# EAGLE design VIC-MIDI_v0.9 (EAGLE 5.11)
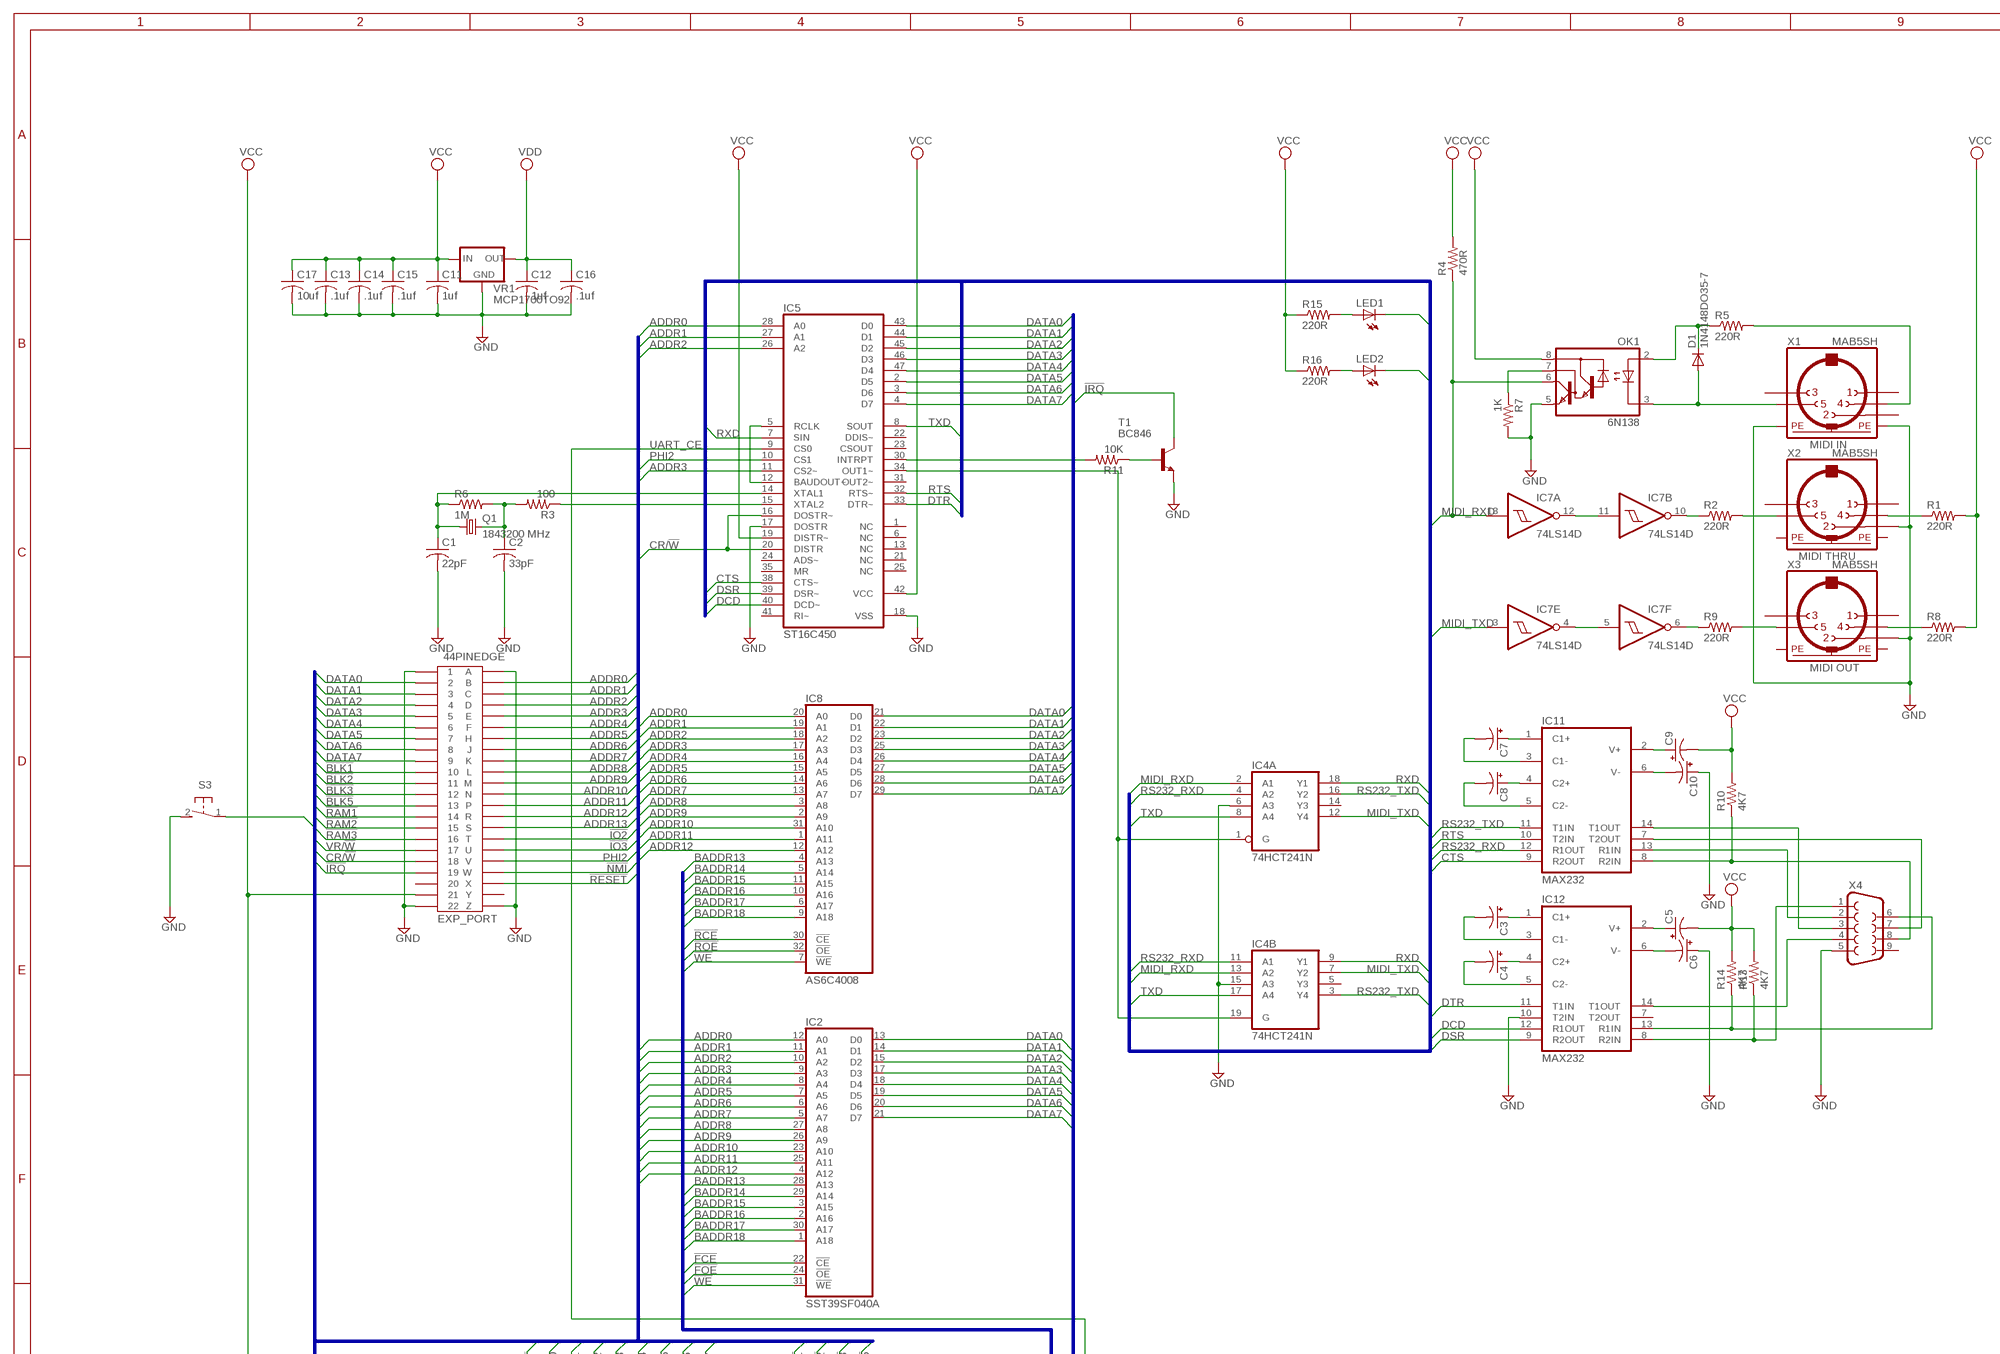
[diagram p0: schematic, sheet 1, part 1 of 3]
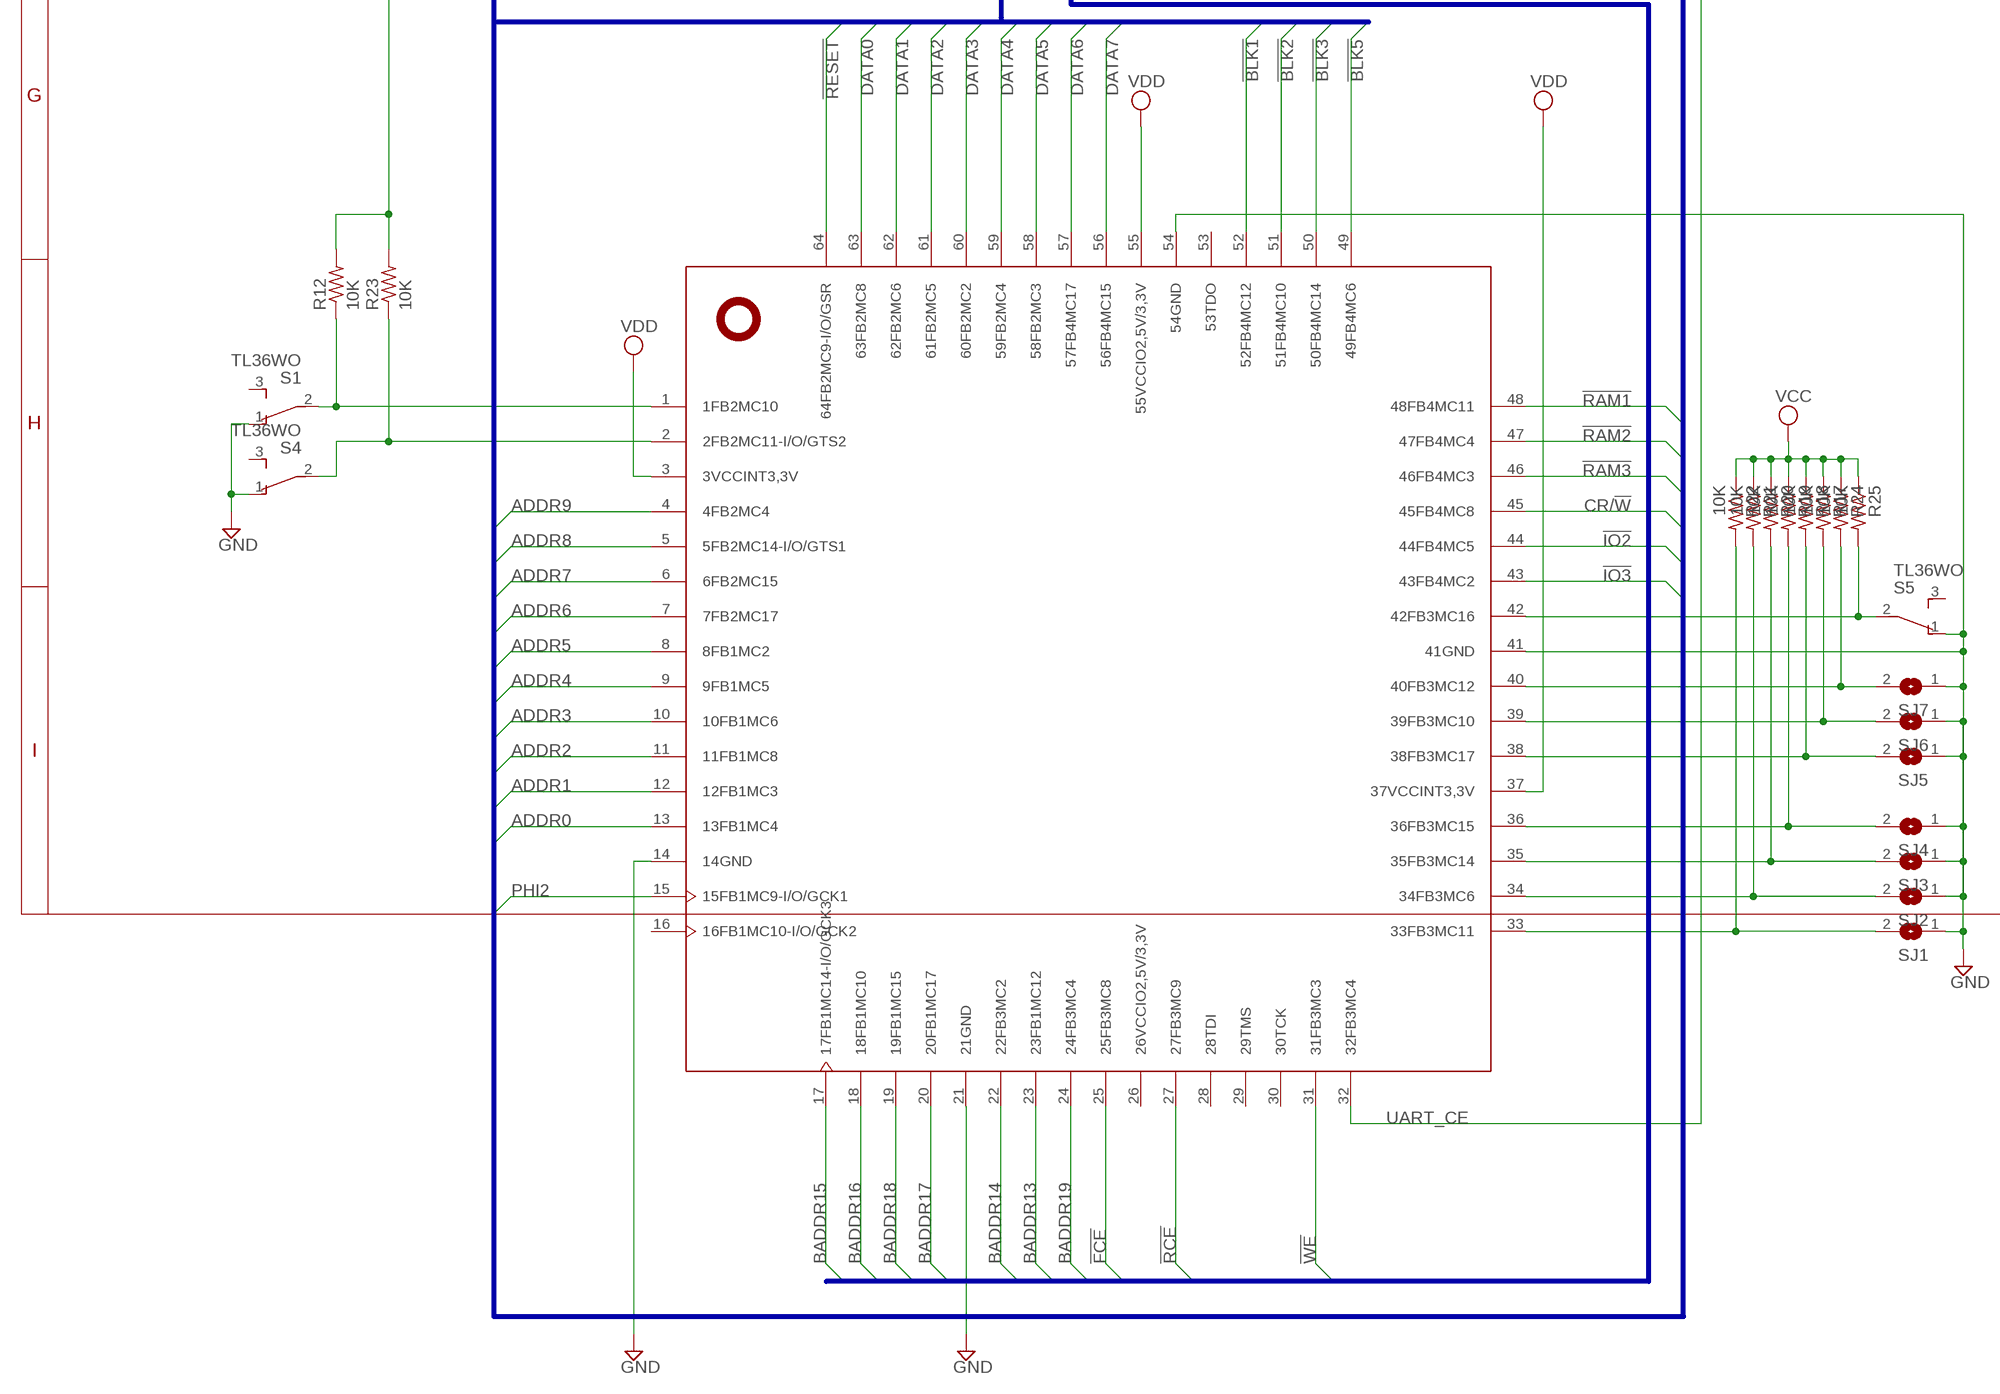
[diagram p1: schematic, sheet 1, part 2 of 3]
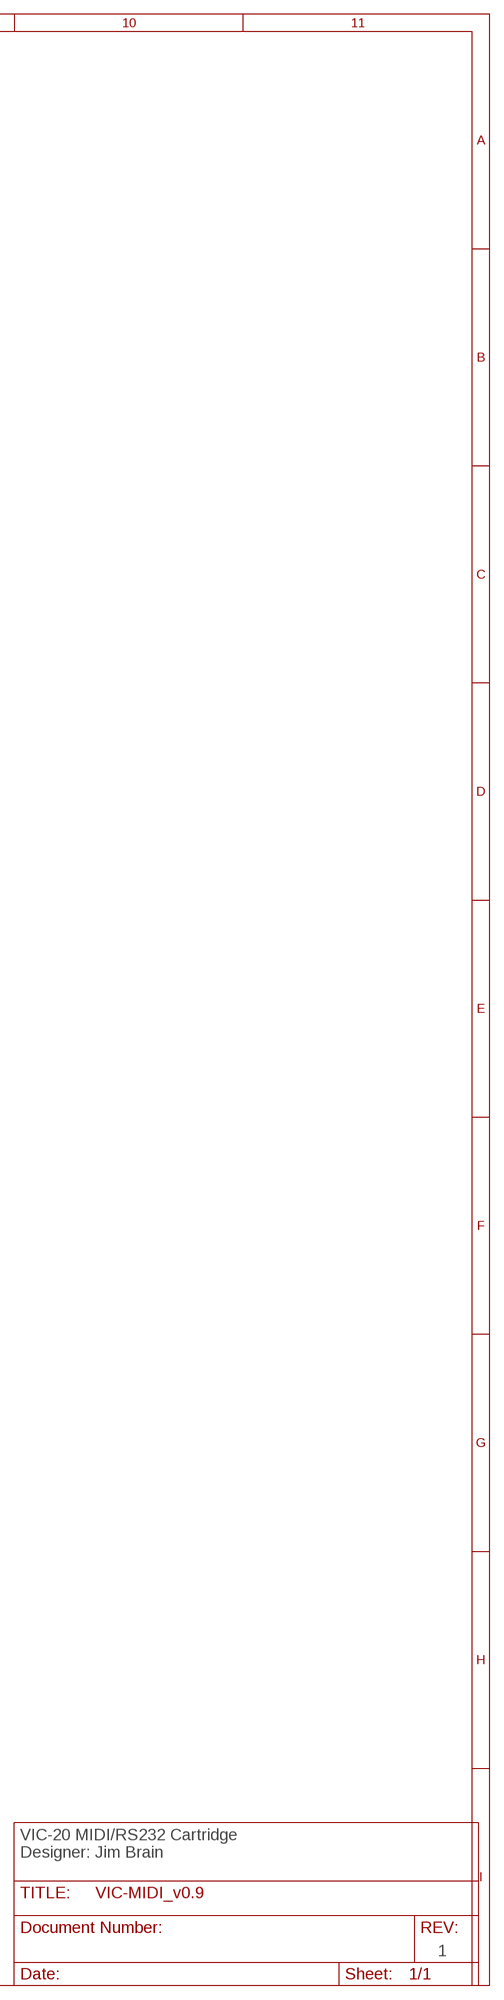
[diagram p2: schematic, sheet 1, part 3 of 3]

## Parts
44PINEDGE  EXP_PORT  MA-44  [MA-44]
C1  22pF  C-USC0805  [C0805]
C2  33pF  C-USC0805  [C0805]
C3  CPOL-USE2-4  [E2-4]
C4  CPOL-USE2-4  [E2-4]
C5  CPOL-USE2-4  [E2-4]
C6  CPOL-USE2-4  [E2-4]
C7  CPOL-USE2-4  [E2-4]
C8  CPOL-USE2-4  [E2-4]
C9  CPOL-USE2-4  [E2-4]
C10  CPOL-USE2-4  [E2-4]
C11  1uf  C-USC0805  [C0805]
C12  1uf  C-USC0805  [C0805]
C13  .1uf  C-USC0805  [C0805]
C14  .1uf  C-USC0805  [C0805]
C15  .1uf  C-USC0805  [C0805]
C16  .1uf  C-USC0805  [C0805]
C17  10uf  C-USC0805  [C0805]
D1  1N4148DO35-7  [DO35-7]
IC1  XC9572XLVQ64  [VQ64]
IC2  SST39SF040A  AM29F040J  [PLCC32R]
IC4  74HCT241N  74LS241DW  [SO20W]
IC5  ST16C450  XR-16C450Q  [TQFP48]
IC7  74LS14D  [SO14]
IC8  AS6C4008  SST39VF040W  [TSOP32]
IC11  MAX232  [DIL16]
IC12  MAX232  [DIL16]
LED1  LED3MM  [LED3MM]
LED2  LED3MM  [LED3MM]
OK1  6N138  [DIL08]
Q1  1843200 MHz  CRYSTALHC49UP  [HC49UP]
R1  220R  R-US_R0805  [R0805]
R2  220R  R-US_R0805  [R0805]
R3  100  R-US_R0805  [R0805]
R4  470R  R-US_R0805  [R0805]
R5  220R  R-US_R0805  [R0805]
R6  1M  R-US_R0805  [R0805]
R7  1K  R-US_R0805  [R0805]
R8  220R  R-US_R0805  [R0805]
R9  220R  R-US_R0805  [R0805]
R10  4K7  R-US_M0805  [M0805]
R11  10K  R-US_R0805  [R0805]
R12  10K  R-US_R0805  [R0805]
R13  4K7  R-US_R0805  [R0805]
R14  4K7  R-US_R0805  [R0805]
R15  220R  R-US_R0805  [R0805]
R16  220R  R-US_R0805  [R0805]
R17  10K  R-US_M0805  [M0805]
R18  10K  R-US_M0805  [M0805]
R19  10K  R-US_M0805  [M0805]
R20  10K  R-US_M0805  [M0805]
R21  10K  R-US_M0805  [M0805]
R22  10K  R-US_M0805  [M0805]
R23  10K  R-US_R0805  [R0805]
R24  10K  R-US_M0805  [M0805]
R25  10K  R-US_M0805  [M0805]
S1  TL36WO  [TL3XWO]
S3  31-XX  [B3F-31XX]
S4  TL36WO  [TL3XWO]
S5  TL36WO  [TL3XWO]
SJ1  SJ  [SJ]
SJ2  SJ  [SJ]
SJ3  SJ  [SJ]
SJ4  SJ  [SJ]
SJ5  SJ  [SJ]
SJ6  SJ  [SJ]
SJ7  SJ  [SJ]
T1  BC846  [SOT23]
VR1  MCP1700TO92  [TO92]
X1  MAB5SH  [MAB5SH]
X2  MAB5SH  [MAB5SH]
X3  MAB5SH  [MAB5SH]
X4  F09HP  [F09HP]

## Nets
!BLK1: 44PINEDGE.10 IC1.52(52FB4MC12)
!BLK2: 44PINEDGE.11 IC1.51(51FB4MC10)
!BLK3: 44PINEDGE.12 IC1.50(50FB4MC14)
!BLK5: 44PINEDGE.13 IC1.49(49FB4MC6)
!FCE: IC1.25(25FB3MC8) IC2.22(!CE)
!FOE: IC2.24(!OE)
!IO2: 44PINEDGE.T IC1.44(44FB4MC5)
!IO3: 44PINEDGE.U IC1.43(43FB4MC2)
!IRQ: 44PINEDGE.19 T1.3(C)
!NMI: 44PINEDGE.W
!RAM1: 44PINEDGE.14 IC1.48(48FB4MC11)
!RAM2: 44PINEDGE.15 IC1.47(47FB4MC4)
!RAM3: 44PINEDGE.16 IC1.46(46FB4MC3)
!RCE: IC1.27(27FB3MC9) IC8.30(!CE)
!RESET: 44PINEDGE.X IC1.64(64FB2MC9-I/O/GSR) S3.1(P)
!ROE: IC8.32(!OE)
!WE: IC1.31(31FB3MC3) IC2.31(!WE) IC8.7(!WE)
ADDR0: 44PINEDGE.B IC1.13(13FB1MC4) IC2.12(A0) IC5.28(A0) IC8.20(A0)
ADDR1: 44PINEDGE.C IC1.12(12FB1MC3) IC2.11(A1) IC5.27(A1) IC8.19(A1)
ADDR2: 44PINEDGE.D IC1.11(11FB1MC8) IC2.10(A2) IC5.26(A2) IC8.18(A2)
ADDR3: 44PINEDGE.E IC1.10(10FB1MC6) IC2.9(A3) IC5.11(CS2~) IC8.17(A3)
ADDR4: 44PINEDGE.F IC1.9(9FB1MC5) IC2.8(A4) IC8.16(A4)
ADDR5: 44PINEDGE.H IC1.8(8FB1MC2) IC2.7(A5) IC8.15(A5)
ADDR6: 44PINEDGE.J IC1.7(7FB2MC17) IC2.6(A6) IC8.14(A6)
ADDR7: 44PINEDGE.K IC1.6(6FB2MC15) IC2.5(A7) IC8.13(A7)
ADDR8: 44PINEDGE.L IC1.5(5FB2MC14-I/O/GTS1) IC2.27(A8) IC8.3(A8)
ADDR9: 44PINEDGE.M IC1.4(4FB2MC4) IC2.26(A9) IC8.2(A9)
ADDR10: 44PINEDGE.N IC2.23(A10) IC8.31(A10)
ADDR11: 44PINEDGE.P IC2.25(A11) IC8.1(A11)
ADDR12: 44PINEDGE.R IC2.4(A12) IC8.12(A12)
ADDR13: 44PINEDGE.S
BADDR13: IC1.23(23FB1MC12) IC2.28(A13) IC8.4(A13)
BADDR14: IC1.22(22FB3MC2) IC2.29(A14) IC8.5(A14)
BADDR15: IC1.17(17FB1MC14-I/O/GCK3) IC2.3(A15) IC8.11(A15)
BADDR16: IC1.18(18FB1MC10) IC2.2(A16) IC8.10(A16)
BADDR17: IC1.20(20FB1MC17) IC2.30(A17) IC8.6(A17)
BADDR18: IC1.19(19FB1MC15) IC2.1(A18) IC8.9(A18)
BADDR19: IC1.24(24FB3MC4)
CR/!W: 44PINEDGE.18 IC1.45(45FB4MC8) IC5.16(DOSTR~) IC5.20(DISTR)
CTS: IC5.38(CTS~) IC11.9(R2OUT)
DATA0: 44PINEDGE.2 IC1.63(63FB2MC8) IC2.13(D0) IC5.43(D0) IC8.21(D0)
DATA1: 44PINEDGE.3 IC1.62(62FB2MC6) IC2.14(D1) IC5.44(D1) IC8.22(D1)
DATA2: 44PINEDGE.4 IC1.61(61FB2MC5) IC2.15(D2) IC5.45(D2) IC8.23(D2)
DATA3: 44PINEDGE.5 IC1.60(60FB2MC2) IC2.17(D3) IC5.46(D3) IC8.25(D3)
DATA4: 44PINEDGE.6 IC1.59(59FB2MC4) IC2.18(D4) IC5.47(D4) IC8.26(D4)
DATA5: 44PINEDGE.7 IC1.58(58FB2MC3) IC2.19(D5) IC5.2(D5) IC8.27(D5)
DATA6: 44PINEDGE.8 IC1.57(57FB4MC17) IC2.20(D6) IC5.3(D6) IC8.28(D6)
DATA7: 44PINEDGE.9 IC1.56(56FB4MC15) IC2.21(D7) IC5.4(D7) IC8.29(D7)
DCD: IC5.40(DCD~) IC12.12(R1OUT)
DSR: IC5.39(DSR~) IC12.9(R2OUT)
DTR: IC5.33(DTR~) IC12.11(T1IN)
EIA_CTS: IC11.8(R2IN) R10.1 X4.8
EIA_DSR: IC12.13(R1IN) R14.1 X4.6
EIA_DTR: IC12.14(T1OUT) X4.4
EIA_RTS: IC11.7(T2OUT) X4.7
EIA_RXD: IC11.13(R1IN) X4.2
EIA_TXD: IC11.14(T1OUT) X4.3
GND: 44PINEDGE.1 44PINEDGE.22 44PINEDGE.A 44PINEDGE.Z C1.2 C2.2 C6.+ C10.+ C11.2 C12.2 C13.2 C14.2 C15.2 C16.2 C17.2 IC1.14(14GND) IC1.21(21GND) IC1.41(41GND) IC1.54(54GND) IC4.6(A:A3) IC4.15(B:A3) IC5.17(DOSTR) IC5.18(VSS) IC12.10(T2IN) OK1.5(GND) R7.2 S1.1(O) S3.2(S) S4.1(O) S5.1(O) SJ1.1 SJ2.1 SJ3.1 SJ4.1 SJ5.1 SJ6.1 SJ7.1 T1.2(E) VR1.1(GND) X1.PE X1.PE@(PE) X2.2 X3.2 X4.5
MIDI_RXD: IC4.2(A:A1) IC4.13(B:A2) IC7.13(A:I) OK1.6(VO) R4.1
MIDI_TXD: IC4.7(B:Y2) IC4.12(A:Y4) IC7.3(E:I)
N$1: R9.2 X3.5
N$2: IC7.6(F:O) R9.1
N$3: R8.1 X3.4
N$4: IC7.4(E:O) IC7.5(F:I)
N$5: LED1.A R15.2
N$6: D1.C OK1.2(A) R5.1
N$7: R5.2 X1.4
N$8: D1.A OK1.3(C) X1.5
N$9: OK1.7(VB) R7.1
N$10: R2.2 X2.5
N$11: IC7.10(B:O) R2.1
N$12: IC7.11(B:I) IC7.12(A:O)
N$13: R1.1 X2.4
N$14: IC1.2(2FB2MC11-I/O/GTS2) R23.1 S4.2(P)
N$15: IC5.15(XTAL2) R3.1
N$16: C1.1 IC5.14(XTAL1) Q1.1 R6.1
N$17: C2.1 Q1.2 R3.2 R6.2
N$18: IC1.42(42FB3MC16) R25.2 S5.2(P)
N$19: IC5.5(RCLK) IC5.12(BAUDOUT~)
N$20: IC1.36(36FB3MC15) R19.2 SJ4.2
N$21: IC1.38(38FB3MC17) R18.2 SJ5.2
N$23: IC1.39(39FB3MC10) R17.2 SJ6.2
N$24: IC1.40(40FB3MC12) R24.2 SJ7.2
N$25: LED2.A R16.2
N$26: IC1.34(34FB3MC6) R21.2 SJ2.2
N$27: IC1.1(1FB2MC10) R12.1 S1.2(P)
N$28: IC1.35(35FB3MC14) R20.2 SJ3.2
N$29: IC1.33(33FB3MC11) R22.2 SJ1.2
N$31: IC5.30(INTRPT) R11.2
N$32: R11.1 T1.1(B)
N$35: IC4.1(A:G) IC4.19(B:G) IC5.34(OUT1~)
N$36: C3.+ IC12.1(C1+)
N$37: C3.- IC12.3(C1-)
N$38: C4.+ IC12.4(C2+)
N$39: C4.- IC12.5(C2-)
N$40: C5.+ IC12.2(V+)
N$41: C6.- IC12.6(V-)
N$42: C7.+ IC11.1(C1+)
N$43: C7.- IC11.3(C1-)
N$44: C8.+ IC11.4(C2+)
N$45: C8.- IC11.5(C2-)
N$46: C9.+ IC11.2(V+)
N$47: C10.- IC11.6(V-)
N$56: IC12.8(R2IN) R13.1 X4.1
PHI2: 44PINEDGE.V IC1.15(15FB1MC9-I/O/GCK1) IC5.10(CS1)
RS232_RXD: IC4.4(A:A2) IC4.11(B:A1) IC11.12(R1OUT)
RS232_TXD: IC4.3(B:Y4) IC4.16(A:Y2) IC11.11(T1IN)
RTS: IC5.32(RTS~) IC11.10(T2IN)
RXD: IC4.9(B:Y1) IC4.18(A:Y1) IC5.7(SIN) LED2.K(C)
TXD: IC4.8(A:A4) IC4.17(B:A4) IC5.8(SOUT) LED1.K(C)
UART_CE: IC1.32(32FB3MC4) IC5.9(CS0)
VCC: 44PINEDGE.21 C5.- C9.- C11.1 C13.1 C14.1 C15.1 C17.1 IC5.19(DISTR~) IC5.42(VCC) OK1.8(VCC) R1.2 R4.2 R8.2 R10.2 R12.2 R13.2 R14.2 R15.1 R16.1 R17.1 R18.1 R19.1 R20.1 R21.1 R22.1 R23.2 R24.1 R25.1 VR1.2(IN)
VDD: C12.1 C16.1 IC1.3(3VCCINT3,3V) IC1.37(37VCCINT3,3V) IC1.55(55VCCIO2,5V/3,3V) VR1.3(OUT)
VR/!W: 44PINEDGE.17
Unconnected: 44PINEDGE.20 44PINEDGE.Y IC1.16(16FB1MC10-I/O/GCK2) IC1.28(28TDI) IC1.29(29TMS) IC1.30(30TCK) IC1.53(53TDO) IC4.5(B:Y3) IC4.14(A:Y3) IC5.1(NC) IC5.6(NC) IC5.13(NC) IC5.21(NC) IC5.22(DDIS~) IC5.23(CSOUT) IC5.24(ADS~) IC5.25(NC) IC5.31(OUT2~) IC5.35(MR) IC5.41(RI~) IC7.1(D:I) IC7.2(D:O) IC7.8(C:O) IC7.9(C:I) IC12.7(T2OUT) S1.3(S) S4.3(S) S5.3(S) X1.1 X1.2 X1.3 X2.1 X2.3 X3.1 X3.3 X4.9

## Buses
DATA[0..7],ADDR[0..13],VR/!W,CR/!W,!BLK1,!BLK2,!BLK3,!BLK5,!RAM1,!RAM2,!RAM3,!IRQ,!NMI,!IO2,!IO3,PHI2,!RESET
RXD,TXD,DCD,RTS,CTS,DSR,DTR,MIDI_RXD,MIDI_TXD,RS232_RXD,RS232_TXD
BADDR[13..19],!FCE,!FOE,!WE,!RCE,!ROE

## Notes on the sheet
- MIDI IN
- MIDI THRU
- MIDI OUT
- VIC-20 MIDI/RS232 Cartridge
- Designer: Jim Brain
- 1

## Power pins joined to a net without a drawn wire
26VCCIO2,5V/3,3V: IC1.26(26VCCIO2,5V/3,3V)
GND: IC2.16(GND) IC4.10(P:GND) IC7.7(P:GND) IC8.24(GND) IC11.15(GND) IC12.15(GND)
PE: X2.PE X2.PE@(PE) X3.PE X3.PE@(PE)
VCC: IC2.32(VCC) IC4.20(P:VCC) IC7.14(P:VCC) IC8.8(VCC) IC11.16(VCC) IC12.16(VCC)

## Library data of the parts
44PINEDGE = con-edge-156:MA-44: 44 PIN EDGE CONNECTOR FOR PCB
C1 C2 C11-C17 = rcl:C-US: CAPACITOR, American symbol
C3-C10 = rcl:CPOL-US: POLARIZED CAPACITOR, American symbol
D1 = diode:1N4148: DIODE high speed (Philips)
IC1 = xilinx_xc9572xl:XC9572XLVQ64
IC2 = am29-memory:AM29F040J: 4-Megabit FLASH MEMORY (512 K x 8 bit) 5 V-only
IC4 = 74xx-us:74*241: Octal BUFFER and LINE DRIVER, 3-state
IC5 = exar:XR-16C450Q: UART
IC7 = 74xx-us:74*14: Hex schmitt trigger INVERTER
IC8 = memory:SST39VF040: 4 Mbit x8 Multi-Purpose Flash Source: http://www.sst.com/dotAsset/40782.pdf
IC11 IC12 = maxim:MAX232: RS232 TRANSEIVER
LED1 LED2 = led:LED: LED OSRAM: - CHIPLED LG R971, LG N971, LY N971, LG Q971, LY Q971, LO R971, LY R971 LH N974, LH R974 LS Q976, LO Q976, LY Q976 LO Q996 - Hyper CHIPLED LW Q18S LB Q993, LB Q99A, LB R99A - SideLED LS A670, LO A670, LY A670, LG A670, LP A670 LB A673, LV A673, LT A673, LW A673 LH A674 LY A675 LS A676, LA A676, LO A676, LY A676, LW A676 LS A679, LY A679, LG A679 - Hyper Micro SIDELED® LS Y876, LA Y876, LO Y876, LY Y876 LT Y87S - SmartLED LW L88C, LW L88S LB L89C, LB L89S, LG L890 LS L89K, LO L89K, LY L89K LS L896, LA L896, LO L896, LY L896 - TOPLED LS T670, LO T670, LY T670, LG T670, LP T670 LSG T670, LSP T670, LSY T670, LOP T670, LYG T670 LG T671, LOG T671, LSG T671 LB T673, LV T673, LT T673, LW T673 LH T674 LS T676, LA T676, LO T676, LY T676, LB T676, LH T676, LSB T676, LW T676 LB T67C, LV T67C, LT T67C, LS T67K, LO T67K, LY T67K, LW E67C LS E67B, LA E67B, LO E67B, LY E67B, LB E67C, LV E67C, LT E67C LW T67C LS T679, LY T679, LG T679 LS T770, LO T770, LY T770, LG T770, LP T770 LB T773, LV T773, LT T773, LW T773 LH T774 LS E675, LA E675, LY E675, LS T675 LS T776, LA T776, LO T776, LY T776, LB T776 LHGB T686 LT T68C, LB T68C - Hyper Mini TOPLED® LB M676 - Mini TOPLED Santana® LG M470 LS M47K, LO M47K, LY M47K Source: http://www.osram.convergy.de LUXEON: - LUMILED® LXK2-PW12-R00, LXK2-PW12-S00, LXK2-PW14-U00, LXK2-PW14-V00 LXK2-PM12-R00, LXK2-PM12-S00, LXK2-PM14-U00 LXK2-PE12-Q00, LXK2-PE12-R00, LXK2-PE12-S00, LXK2-PE14-T00, LXK2-PE14-U00 LXK2-PB12-K00, LXK2-PB12-L00, LXK2-PB12-M00, LXK2-PB14-N00, LXK2-PB14-P00, LXK2-PB14-Q00 LXK2-PR12-L00, LXK2-PR12-M00, LXK2-PR14-Q00, LXK2-PR14-R00 LXK2-PD12-Q00, LXK2-PD12-R00, LXK2-PD12-S00 LXK2-PH12-R00, LXK2-PH12-S00 LXK2-PL12-P00, LXK2-PL12-Q00, LXK2-PL12-R00 Source: www.luxeon.com KINGBRIGHT: KA-3528ASYC Source: www.kingbright.com
OK1 = optocoupler:6N138: MOTOROLA OPTO COUPLER; MF: VISHAY/TELEFUNKEN; MPN: 6N138; OC_FARNELL: 9860150; OC_NEWARK: 35K5294
Q1 = crystal:CRYSTAL: CRYSTAL
R1-R9 R11 R12 R15-R25 = resistor:R-US_: RESISTOR, American symbol
R10 R13 R14 = rcl:R-US_: RESISTOR, American symbol
S1 S4 S5 = switch:TL36WO: TINY SWITCH ON - ON Source: http://www2.produktinfo.conrad.com/datenblaetter/700000-724999/705152-da-01-de-Subminiaturschalter_TL_36WO.pdf
S3 = switch-omron:31-XX: OMRON SWITCH; MPN: B3F-3100; OC_FARNELL: 959704; OC_NEWARK: 36M3582
SJ1-SJ7 = jumper:SJ: SMD solder JUMPER
T1 = transistor:BC846: NPN TRANSISTOR
VR1 = microchip-vr:MCP1700: MCP1700 Low Quiescent Current LDO Voltage Regulator
X1-X3 = con-hirschmann:MAB5SH: Female CONNECTOR 5 pins 90 deg. with shield, horizontal (DIN 41524)
X4 = con-subd:F09: SUB-D; OC_FARNELL: unknown; OC_NEWARK: unknown

## Board
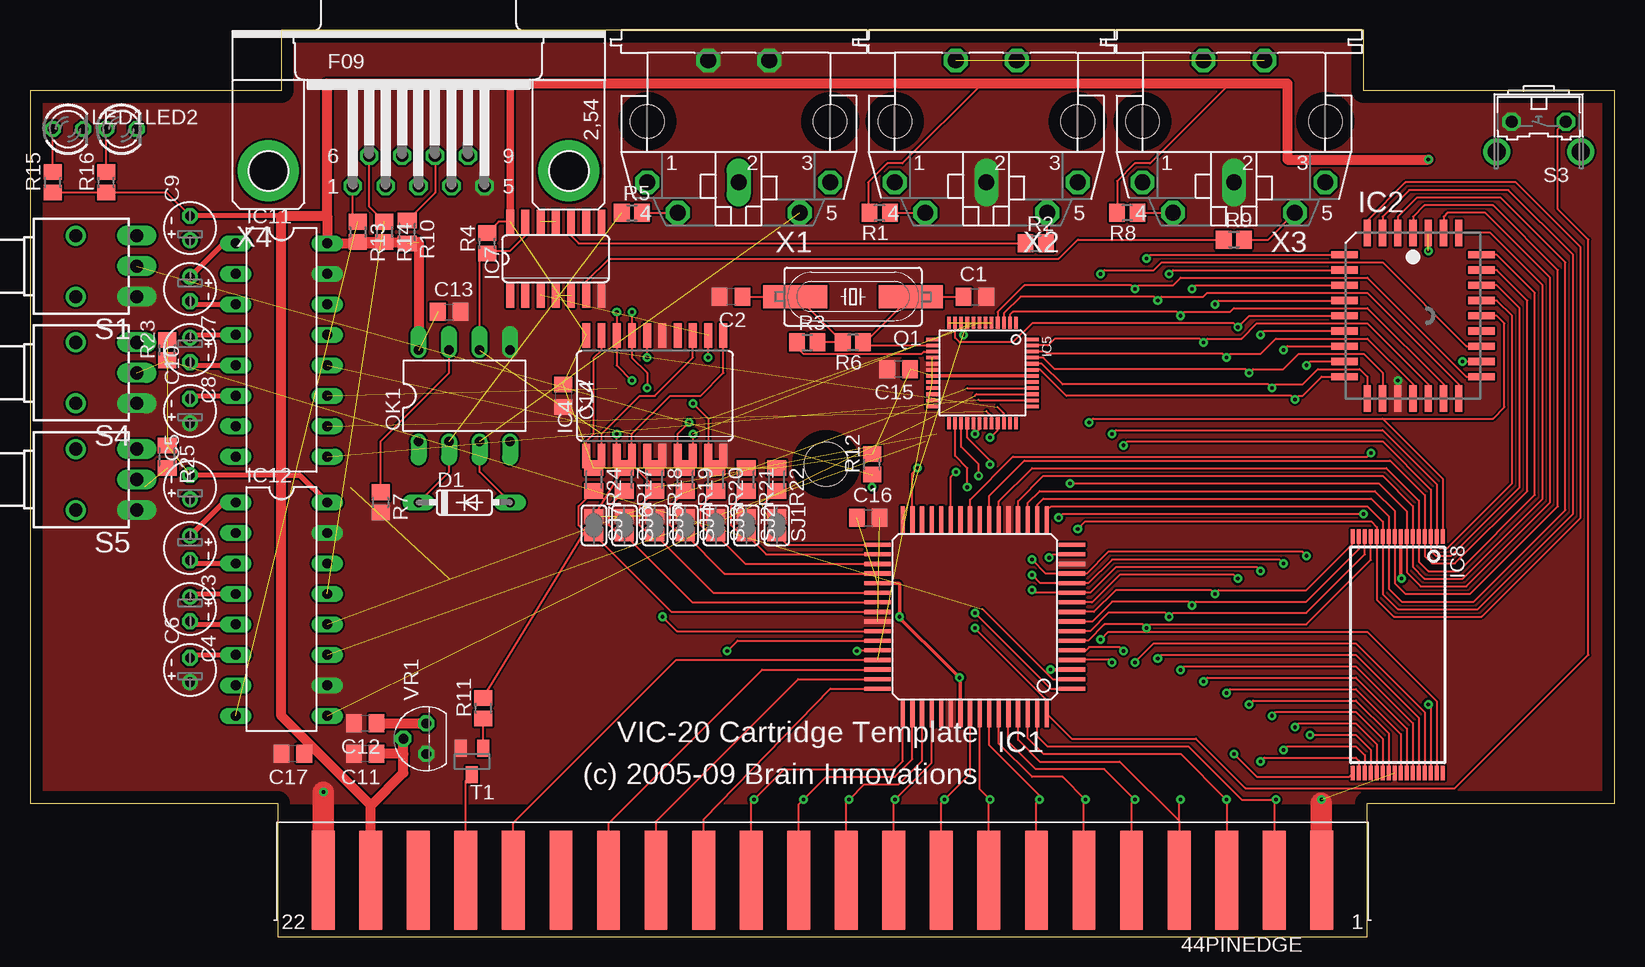
[diagram p3: board, top side]
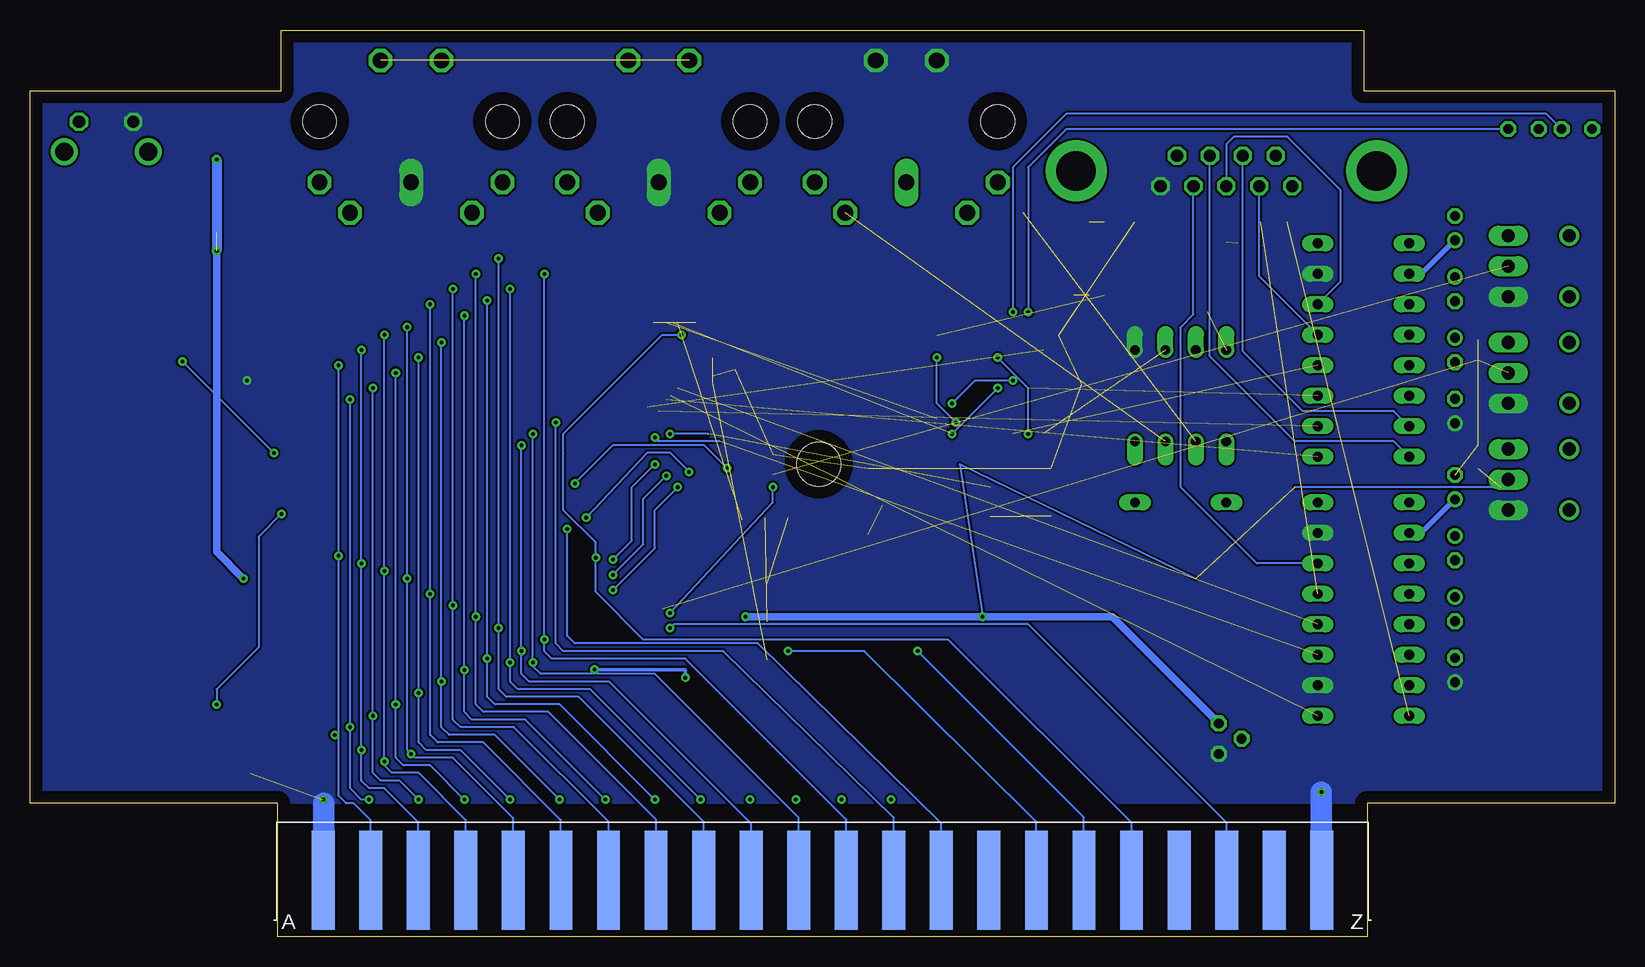
[diagram p4: board, bottom side, seen from below]

Size 132.08 x 75.56 mm. Coordinates in mm from the lower left corner, seen from the top.
Outline: 20.64,0 111.44,0 111.44,11.11 132.08,11.11 132.08,70.48 111.12,70.48 111.12,75.56 20.95,75.56 20.95,70.48 0,70.48 0,11.11 20.64,11.11 20.64,0
Copper layers (1*16): Top 0.035mm / dielectric 1.5mm / Bottom 0.035mm
Design rules "ourpcb-small": minimum track width 4mil, minimum drill 12mil, track to track 4mil, track to pad 4mil, pad to pad 4mil, via to via 4mil, smd to smd 0mil, copper to edge 40mil, drill to drill 8mil, minimum pad ring 10mil, minimum via ring 8mil, stop-mask expansion 4mil, vias tented up to drill 0mil, thermal gap 10mil
Holes 3.64 mm at 66.36,39.37

### Footprints (pad centres in the part's own frame; a part is rotated, then mirrored left to right if it is on the bottom)
MA-44 = smd 1.905 x 8.255: 1 -41.605,4.826; 2 -37.643,4.826; 3 -33.68,4.826; 4 -29.718,4.826; 5 -25.756,4.826; 6 -21.793,4.826; 7 -17.831,4.826; 8 -13.868,4.826; 9 -9.906,4.826; 10 -5.944,4.826; 11 -1.981,4.826; 12 1.981,4.826; 13 5.944,4.826; 14 9.906,4.826; 15 13.868,4.826; 16 17.831,4.826; 17 21.793,4.826; 18 25.756,4.826; 19 29.718,4.826; 20 33.68,4.826; 21 37.643,4.826; 22 41.605,4.826 | smd 1.905 x 8.255 bottom: A -41.605,4.826; B -37.643,4.826; C -33.68,4.826; D -29.718,4.826; E -25.756,4.826; F -21.793,4.826; H -17.831,4.826; J -13.868,4.826; K -9.906,4.826; L -5.944,4.826; M -1.981,4.826; N 1.981,4.826; P 5.944,4.826; R 9.906,4.826; S 13.868,4.826; T 17.831,4.826; U 21.793,4.826; V 25.756,4.826; W 29.718,4.826; X 33.68,4.826; Y 37.643,4.826; Z 41.605,4.826
C0805 = smd 1.3 x 1.5: 1 -0.95,0; 2 0.95,0
E2-4 = drill 0.813 pad 1.27 round: + -1.016,0 | drill 0.813 pad 1.27 octagon: - 1.016,0
DO35-7 = drill 0.813 long: A 3.81,0; C -3.81,0
VQ64 = smd 2.2 x 0.35: 1 -8.1,5.365; 2 -8.1,4.565; 3 -8.1,3.765; 4 -8.1,2.965; 5 -8.1,2.165; 6 -8.1,1.365; 7 -8.1,0.565; 8 -8.1,-0.235; 9 -8.1,-1.035; 10 -8.1,-1.835; 11 -8.1,-2.635; 12 -8.1,-3.435; 13 -8.1,-4.235; 14 -8.1,-5.035; 15 -8.1,-5.835; 16 -8.1,-6.635; 33 8.1,-6.635; 34 8.1,-5.835; 35 8.1,-5.035; 36 8.1,-4.235; 37 8.1,-3.435; 38 8.1,-2.635; 39 8.1,-1.835; 40 8.1,-1.035; 41 8.1,-0.235; 42 8.1,0.565; 43 8.1,1.365; 44 8.1,2.165; 45 8.1,2.965; 46 8.1,3.765; 47 8.1,4.565; 48 8.1,5.365 | smd 0.35 x 2.2: 17 -6,-8.735; 18 -5.2,-8.735; 19 -4.4,-8.735; 20 -3.6,-8.735; 21 -2.8,-8.735; 22 -2,-8.735; 23 -1.2,-8.735; 24 -0.4,-8.735; 25 0.4,-8.735; 26 1.2,-8.735; 27 2,-8.735; 28 2.8,-8.735; 29 3.6,-8.735; 30 4.4,-8.735; 31 5.2,-8.735; 32 6,-8.735; 49 6,7.465; 50 5.2,7.465; 51 4.4,7.465; 52 3.6,7.465; 53 2.8,7.465; 54 2,7.465; 55 1.2,7.465; 56 0.4,7.465; 57 -0.4,7.465; 58 -1.2,7.465; 59 -2,7.465; 60 -2.8,7.465; 61 -3.6,7.465; 62 -4.4,7.465; 63 -5.2,7.465; 64 -6,7.465
PLCC32R = smd 0.6 x 2.2: 1 0,6.9; 2 -1.27,6.9; 3 -2.54,6.9; 4 -3.81,6.9; 14 -3.81,-6.9; 15 -2.54,-6.9; 16 -1.27,-6.9; 17 0,-6.9; 18 1.27,-6.9; 19 2.54,-6.9; 20 3.81,-6.9; 30 3.81,6.9; 31 2.54,6.9; 32 1.27,6.9 | smd 2.2 x 0.6: 5 -5.7,5.08; 6 -5.7,3.81; 7 -5.7,2.54; 8 -5.7,1.27; 9 -5.7,0; 10 -5.7,-1.27; 11 -5.7,-2.54; 12 -5.7,-3.81; 13 -5.7,-5.08; 21 5.7,-5.08; 22 5.7,-3.81; 23 5.7,-2.54; 24 5.7,-1.27; 25 5.7,0; 26 5.7,1.27; 27 5.7,2.54; 28 5.7,3.81; 29 5.7,5.08
SO20W = smd 0.66 x 2.032: 1 -5.715,-5.029; 2 -4.445,-5.029; 3 -3.175,-5.029; 4 -1.905,-5.029; 5 -0.635,-5.029; 6 0.635,-5.029; 7 1.905,-5.029; 8 3.175,-5.029; 9 4.445,-5.029; 10 5.715,-5.029; 11 5.715,5.029; 12 4.445,5.029; 13 3.175,5.029; 14 1.905,5.029; 15 0.635,5.029; 16 -0.635,5.029; 17 -1.905,5.029; 18 -3.175,5.029; 19 -4.445,5.029; 20 -5.715,5.029
TQFP48 = smd 1.016 x 0.305: 1 -4.191,2.794; 2 -4.191,2.286; 3 -4.191,1.778; 4 -4.191,1.27; 5 -4.191,0.762; 6 -4.191,0.254; 7 -4.191,-0.254; 8 -4.191,-0.762; 9 -4.191,-1.27; 10 -4.191,-1.778; 11 -4.191,-2.286; 12 -4.191,-2.794; 25 4.191,-2.794; 26 4.191,-2.286; 27 4.191,-1.778; 28 4.191,-1.27; 29 4.191,-0.762; 30 4.191,-0.254; 31 4.191,0.254; 32 4.191,0.762; 33 4.191,1.27; 34 4.191,1.778; 35 4.191,2.286; 36 4.191,2.794 | smd 0.305 x 1.016: 13 -2.794,-4.191; 14 -2.286,-4.191; 15 -1.778,-4.191; 16 -1.27,-4.191; 17 -0.762,-4.191; 18 -0.254,-4.191; 19 0.254,-4.191; 20 0.762,-4.191; 21 1.27,-4.191; 22 1.778,-4.191; 23 2.286,-4.191; 24 2.794,-4.191; 37 2.794,4.191; 38 2.286,4.191; 39 1.778,4.191; 40 1.27,4.191; 41 0.762,4.191; 42 0.254,4.191; 43 -0.254,4.191; 44 -0.762,4.191; 45 -1.27,4.191; 46 -1.778,4.191; 47 -2.286,4.191; 48 -2.794,4.191
SO14 = smd 0.66 x 2.032: 1 -3.81,-3.073; 2 -2.54,-3.073; 3 -1.27,-3.073; 4 0,-3.073; 5 1.27,-3.073; 6 2.54,-3.073; 7 3.81,-3.073; 8 3.81,3.073; 9 2.54,3.073; 10 1.27,3.073; 11 0,3.073; 12 -1.27,3.073; 13 -2.54,3.073; 14 -3.81,3.073
TSOP32 = smd 1.2 x 0.36: 1 -9.85,3.75; 2 -9.85,3.25; 3 -9.85,2.75; 4 -9.85,2.25; 5 -9.85,1.75; 6 -9.85,1.25; 7 -9.85,0.75; 8 -9.85,0.25; 9 -9.85,-0.25; 10 -9.85,-0.75; 11 -9.85,-1.25; 12 -9.85,-1.75; 13 -9.85,-2.25; 14 -9.85,-2.75; 15 -9.85,-3.25; 16 -9.85,-3.75; 17 9.85,-3.75; 18 9.85,-3.25; 19 9.85,-2.75; 20 9.85,-2.25; 21 9.85,-1.75; 22 9.85,-1.25; 23 9.85,-0.75; 24 9.85,-0.25; 25 9.85,0.25; 26 9.85,0.75; 27 9.85,1.25; 28 9.85,1.75; 29 9.85,2.25; 30 9.85,2.75; 31 9.85,3.25; 32 9.85,3.75
DIL16 = drill 0.813 long: 1 -8.89,-3.81; 2 -6.35,-3.81; 3 -3.81,-3.81; 4 -1.27,-3.81; 5 1.27,-3.81; 6 3.81,-3.81; 7 6.35,-3.81; 8 8.89,-3.81; 9 8.89,3.81; 10 6.35,3.81; 11 3.81,3.81; 12 1.27,3.81; 13 -1.27,3.81; 14 -3.81,3.81; 15 -6.35,3.81; 16 -8.89,3.81
LED3MM = drill 0.813 octagon: A -1.27,0; K 1.27,0
DIL08 = drill 0.813 offset: 1 -3.81,-3.81; 2 -1.27,-3.81; 3 1.27,-3.81; 4 3.81,-3.81; 5 3.81,3.81; 6 1.27,3.81; 7 -1.27,3.81; 8 -3.81,3.81
HC49UP = smd 5.334 x 1.93: 1 -4.826,0; 2 4.826,0
R0805 = smd 1.3 x 1.5: 1 -0.85,0; 2 0.85,0
M0805 = smd 1.3 x 1.6: 1 -0.95,0; 2 0.95,0
TL3XWO = drill 1.1 pad 1.422 long: 1 -2.54,-5.08; 2 0,-5.08; 3 2.54,-5.08 | drill 1.1 pad 1.676 round: M1 -2.54,0; M2 2.54,0
B3F-31XX = drill 1.016 octagon: 1 -2.261,-1.245; 2 2.261,-1.245 | drill 1.499 pad 2.159 round: 3 -3.505,1.245; 4 3.505,1.245
SJ = smd 1.168 x 1.6: 1 -0.762,0; 2 0.762,0
SOT23 = smd 1 x 1.4: 1 -0.95,-1.1; 2 0.95,-1.1; 3 0,1.1
TO92 = drill 0.813 octagon: 1 -1.27,0; 2 0,1.905; 3 1.27,0
MAB5SH = drill 1.321 octagon: 1 7.62,5.08; 3 -7.62,5.08; 4 5.08,7.62; 5 -5.08,7.62; PE -2.54,-5.08; PE@ 2.54,-5.08 | drill 1.321 long: 2 0,5.08 | hole 2.794: 7.62,0; -7.62,0
F09HP = drill 1.016 octagon: 1 -5.486,-1.27; 2 -2.743,-1.27; 3 0,-1.27; 4 2.743,-1.27; 5 5.486,-1.27; 6 -4.115,1.27; 7 -1.372,1.27; 8 1.372,1.27; 9 4.115,1.27 | drill 3.302 pad 5.08 round: G1 -12.522,0; G2 12.522,0

### Placement (x,y rotation side)
44PINEDGE  66.04,9.53 180 top
C1  78.74,53.34 0 top
C2  58.42,53.34 180 top
C3  13.34,32.38 270 top
C4  13.34,27.3 270 top
C5  13.34,37.47 90 top
C6  13.34,22.23 90 top
C7  13.34,53.98 270 top
C8  13.34,48.9 270 top
C9  13.34,59.05 90 top
C10  13.34,43.81 90 top
C11  27.94,15.24 180 top
C12  27.94,17.78 180 top
C13  34.92,52.07 0 top
C14  44.45,45.09 270 top
C15  72.39,47.31 180 top
C16  69.85,34.92 0 top
C17  21.91,15.24 180 top
D1  36.2,36.2 0 top
IC1  78.74,26.04 180 top
IC2  115.25,51.75 0 top
IC4  52.07,45.09 0 top
IC5  79.38,46.99 270 top
IC7  43.82,56.52 0 top
IC8  113.98,23.5 270 top
IC11  20.95,48.9 270 top
IC12  20.95,27.3 270 top
LED1  3.17,67.31 0 top
LED2  7.62,67.31 0 top
OK1  36.2,45.09 0 top
Q1  68.58,53.34 180 top
R1  70.8,60.33 180 top
R2  83.82,57.78 0 top
R3  64.77,49.53 0 top
R4  38.1,57.78 90 top
R5  50.16,60.33 0 top
R6  68.58,49.53 180 top
R7  29.21,36.2 270 top
R8  91.44,60.33 180 top
R9  100.33,58.1 0 top
R10  31.43,58.74 270 top
R11  37.78,19.05 90 top
R12  70.17,39.37 90 top
R13  27.3,58.74 270 top
R14  29.53,58.74 270 top
R15  1.9,62.87 90 top
R16  6.35,62.87 90 top
R17  49.53,38.1 270 top
R18  52.07,38.1 270 top
R19  54.61,38.1 270 top
R20  57.15,38.1 270 top
R21  59.69,38.1 270 top
R22  62.23,38.1 270 top
R23  11.43,48.9 90 top
R24  46.99,38.1 270 top
R25  11.43,40.01 270 top
S1  3.81,55.88 90 top
S3  125.73,66.67 180 top
S4  3.81,46.99 90 top
S5  3.81,38.1 90 top
SJ1  62.23,34.29 270 top
SJ2  59.69,34.29 270 top
SJ3  57.15,34.29 270 top
SJ4  54.61,34.29 270 top
SJ5  52.07,34.29 270 top
SJ6  49.53,34.29 270 top
SJ7  46.99,34.29 270 top
T1  36.83,14.61 180 top
VR1  33.02,16.51 90 top
X1  59.05,67.94 180 top
X2  79.69,67.94 180 top
X3  100.33,67.94 180 top
X4  32.38,63.82 0 top

### Tracks (layer width: path | path; a pad name or v marks a point on that pad's centre or on a via)
!BLK1  (via drill 0.3)
  Top 0.152: IC1.52 75.14,14.5 v72.07,11.43 71.98,11.34 44PINEDGE.10
!BLK2  (via drill 0.3)
  Top 0.152: 44PINEDGE.11 68.02,11.19 v68.26,11.43 69.53,12.7 72.39,12.7 74.34,14.65 IC1.51
!BLK3  (via drill 0.3)
  Top 0.152: 44PINEDGE.12 64.06,11.04 v64.45,11.43 66.36,13.34 72.07,13.34 73.54,14.8 IC1.50
!BLK5  (via drill 0.3)
  Top 0.152: 44PINEDGE.13 60.1,11.2 v60.33,11.43 62.87,13.97 72.07,13.97 72.74,14.64 IC1.49
!FCE  (via drill 0.3)
  Top 0.152: IC1.25 78.34,36.43 81.91,40.01 111.44,40.01 v111.76,40.32 | v119.38,47.94 IC2.22
  Bottom 0.152: v111.76,40.32 v119.38,47.94
!IO2  (via drill 0.3)
  Top 0.152: v68.9,23.81 68.95,23.87 IC1.44
  Bottom 0.152: 44PINEDGE.T 48.21,9.58 62.55,23.81 v68.9,23.81
!IO3  (via drill 0.3)
  Top 0.152: IC1.43 58.96,24.67 v58.1,23.81
  Bottom 0.152: 44PINEDGE.U 44.25,9.96 v58.1,23.81
!IRQ
  Top 0.152: 44PINEDGE.19 36.32,13 T1.3
!RAM1
  Top 0.152: 44PINEDGE.14 56.13,9.78 66.71,20.67 IC1.48
!RAM2
  Top 0.152: IC1.47 64.02,21.47 52.17,9.63 44PINEDGE.15
!RAM3
  Top 0.152: IC1.46 61.01,22.27 48.21,9.47 44PINEDGE.16
!RCE  (via drill 0.3)
  Top 0.152: IC1.27 76.74,38.32 v77.15,38.73 | v85.72,34.92 86.04,35.24 v111.12,35.24 | IC8.30 116.73,19.16 v116.52,19.37
  Bottom 0.152: v77.15,38.73 78.74,40.32 80.64,40.32 v85.72,34.92 | v111.12,35.24 113.03,33.34 113.03,24.13 116.52,20.64 v116.52,19.37
!RESET  (via drill 0.3)
  Top 0.152: v78.74,25.72 84.74,19.72 IC1.64 86.8,16.51 97.16,16.51 101.28,12.38 118.74,12.38 129.86,23.5 129.86,58.1 127.32,60.64 127.32,67.31 127.93,67.92 S3.1
  Bottom 0.152: 44PINEDGE.X 32.36,9.5 48.9,26.04 78.42,26.04 v78.74,25.72
!WE  (via drill 0.3)
  Top 0.152: IC2.31 117.79,60.01 118.11,60.33 121.28,60.33 126.68,54.93 126.68,36.2 119.7,29.21 115.89,29.21 114.73,30.36 IC8.7 114.73,35.45 112.39,37.78 v86.68,37.78 | IC1.31 73.54,38.62 v73.98,39.05
  Bottom 0.152: v73.98,39.05 75.88,40.96 83.5,40.96 v86.68,37.78
ADDR0  (via drill 0.3)
  Top 0.152: IC8.20 111.73,15.59 110.49,16.83 v106.68,16.83 | IC2.12 106.68,47.94 v106.36,47.62 | v106.36,31.75 106.04,32.07 89.85,32.07 88.05,30.27 IC1.13 84.66,30.27 v83.5,31.43 | IC5.28 78.1,41.59 80.01,39.69 v80.01,39.37
  Bottom 0.152: 44PINEDGE.B 103.68,9.7 105.09,11.11 105.73,11.11 106.36,11.75 106.36,16.51 | 106.36,16.51 v106.36,31.75 v106.36,47.62 | 106.36,16.51 v106.68,16.83 | v80.01,39.37 81.91,37.47 81.91,33.02 v83.5,31.43
ADDR1  (via drill 0.3)
  Top 0.152: IC8.19 111.23,15.13 110.49,15.88 104.77,15.88 v104.46,15.56 | IC2.11 104.77,49.21 v104.46,48.9 | v104.46,31.11 104.14,31.43 90.17,31.43 88.21,29.47 IC1.12 84.19,29.47 v83.5,30.16 | IC5.27 77.6,40.83 79.06,39.37 v79.06,38.42
  Bottom 0.152: 44PINEDGE.C 99.72,9.55 102.55,12.38 103.82,12.38 104.46,13.02 v104.46,15.56 v104.46,31.11 v104.46,48.9 | v79.06,38.42 80.96,36.51 80.96,32.7 v83.5,30.16
ADDR2  (via drill 0.3)
  Top 0.152: IC8.18 110.73,14.68 110.49,14.92 102.87,14.92 v102.55,14.61 | IC2.10 102.87,50.48 v102.55,50.16 | v102.55,30.48 102.23,30.8 90.49,30.8 88.36,28.67 IC1.11 83.72,28.67 v83.5,28.89 | IC5.26 77.09,40.07 78.1,39.05 v78.1,37.47
  Bottom 0.152: 44PINEDGE.D 95.76,9.72 99.69,13.65 101.92,13.65 102.55,14.29 v102.55,14.61 v102.55,30.48 v102.55,50.16 | v78.1,37.47 80.01,35.56 80.01,32.38 v83.5,28.89
ADDR3  (via drill 0.3)
  Top 0.152: IC2.9 101.6,51.75 v100.65,50.8 100.33,51.12 83.5,51.12 81.91,49.53 77.47,49.53 77.09,49.91 IC5.11 | IC8.17 109.92,13.34 102.23,13.34 v100.33,15.24 | v100.65,29.84 100.33,30.16 90.8,30.16 88.51,27.87 IC1.10
  Bottom 0.152: 44PINEDGE.E 91.8,9.88 96.84,14.92 100.01,14.92 v100.33,15.24 100.65,15.56 v100.65,29.84 v100.65,50.8
ADDR4  (via drill 0.3)
  Top 0.152: 110.23,33.08 IC8.16 110.23,32.76 106.36,28.89 99.06,28.89 v98.74,28.57 98.42,28.89 90.49,28.89 88.66,27.07 IC1.9 | IC2.8 99.06,53.02 v98.74,52.7
  Bottom 0.152: 44PINEDGE.F 87.83,9.73 94.3,16.19 98.11,16.19 98.74,16.83 v98.74,28.57 v98.74,52.7
ADDR5  (via drill 0.3)
  Top 0.152: IC8.15 110.73,32.31 106.36,27.94 97.16,27.94 v96.84,27.62 96.52,27.94 90.17,27.94 88.5,26.27 IC1.8 | IC2.7 97.16,54.29 v96.84,53.98
  Bottom 0.152: 44PINEDGE.H 83.87,9.58 91.76,17.46 96.2,17.46 96.84,18.1 v96.84,27.62 v96.84,53.98
ADDR6  (via drill 0.3)
  Top 0.152: IC2.6 95.25,55.56 v94.93,55.24 | IC8.14 111.23,31.86 106.36,26.99 95.25,26.99 v94.93,26.67 94.61,26.99 89.85,26.99 88.33,25.47 IC1.7
  Bottom 0.152: 44PINEDGE.J 79.91,9.74 88.9,18.73 94.3,18.73 94.93,19.37 v94.93,26.67 v94.93,55.24
ADDR7  (via drill 0.3)
  Top 0.152: IC2.5 93.34,56.83 v93.03,56.52 | IC8.13 111.73,31.41 106.36,26.04 93.34,26.04 v93.03,25.72 92.71,26.04 89.53,26.04 88.17,24.67 IC1.6
  Bottom 0.152: 44PINEDGE.K 75.95,9.59 86.36,20 92.39,20 93.03,20.64 v93.03,25.72 v93.03,56.52
ADDR8  (via drill 0.3)
  Top 0.152: v91.12,40.96 91.44,41.27 112.71,41.27 116.73,37.26 IC8.3 116.73,32.17 117.16,31.75 118.43,31.75 124.14,37.47 124.14,52.39 122.24,54.29 IC2.27 | v91.12,23.81 90.8,24.13 88.27,24.13 88,23.87 IC1.5
  Bottom 0.152: 44PINEDGE.L 71.98,9.44 83.82,21.27 90.49,21.27 91.12,21.91 v91.12,23.81 v91.12,40.96
ADDR9  (via drill 0.3)
  Top 0.152: v90.17,41.91 90.49,42.23 112.71,42.23 117.23,37.71 IC8.2 117.23,32.63 117.47,32.38 118.11,32.38 123.51,37.78 123.51,51.75 122.24,53.02 IC2.26 | IC1.4 89.96,23.07 v90.17,22.86
  Bottom 0.152: 44PINEDGE.M 68.02,9.92 80.01,21.91 89.53,21.91 90.17,22.54 v90.17,22.86 v90.17,41.91
ADDR10  (via drill 0.3)
  Top 0.152: IC8.31 117.23,19.61 111.44,25.4 89.85,25.4 v89.22,24.77 | IC2.23 119.7,49.21 112.71,56.2 94.3,56.2 93.66,55.56 89.53,55.56 v89.22,55.24
  Bottom 0.152: 44PINEDGE.N 64.06,9.77 77.47,23.18 88.58,23.18 89.22,23.81 v89.22,24.77 v89.22,55.24
ADDR11  (via drill 0.3)
  Top 0.152: IC8.1 117.73,38.16 112.71,43.18 | 112.71,43.18 88.58,43.18 v88.27,42.86 | IC2.25 122.24,51.75 122.87,51.12 122.87,44.13 121.92,43.18 112.71,43.18
  Bottom 0.152: 44PINEDGE.P 60.1,9.93 74.29,23.81 87.63,23.81 88.27,24.45 v88.27,42.86
ADDR12  (via drill 0.3)
  Top 0.152: v87.31,33.97 87.95,34.61 111.76,34.61 112.23,34.13 IC8.12 112.23,28.1 113.66,26.67 120.97,26.67 129.22,34.92 129.22,57.47 123.82,62.87 114.62,62.87 111.44,59.69 IC2.4
  Bottom 0.152: 44PINEDGE.R 56.13,9.46 71.44,24.45 86.68,24.45 87.31,25.08 v87.31,33.97
BADDR13
  Top 0.152: IC2.28 122.24,55.56 124.78,53.02 124.78,37.15 118.74,31.11 116.84,31.11 116.23,31.72 IC8.4 116.23,36.8 113.35,39.69 82.87,39.69 79.94,36.76 IC1.23
BADDR14
  Top 0.152: IC2.29 122.24,56.83 125.41,53.66 125.41,36.83 119.06,30.48 116.52,30.48 115.73,31.27 IC8.5 115.73,36.35 113.03,39.05 83.5,39.05 80.74,36.29 IC1.22
BADDR15
  Top 0.152: IC2.3 112.71,60.01 114.93,62.23 123.19,62.23 128.59,56.83 128.59,35.24 120.65,27.3 113.98,27.3 112.73,28.55 IC8.11 112.73,34.59 111.44,35.88 85.09,35.88 84.74,35.53 IC1.17
BADDR16
  Top 0.152: IC2.2 113.98,60.01 115.57,61.59 122.55,61.59 127.95,56.2 127.95,35.56 120.33,27.94 114.3,27.94 113.23,29.01 IC8.10 113.23,35.04 111.76,36.51 84.45,36.51 83.94,36 IC1.18
BADDR17
  Top 0.152: IC2.30 121.69,58.65 126.05,54.29 126.05,36.51 119.38,29.84 116.2,29.84 115.23,30.82 IC8.6 115.23,35.9 112.71,38.42 84.45,38.42 82.34,36.3 IC1.20
BADDR18
  Top 0.152: IC2.1 115.25,60.01 116.2,60.96 121.92,60.96 127.32,55.56 127.32,35.88 120.02,28.57 114.62,28.57 113.73,29.46 IC8.9 113.73,35.49 112.08,37.15 84.14,37.15 83.14,36.15 IC1.19
CR/!W  (2 unrouted)
  Top 0.152: 44PINEDGE.18 40.28,9.49 53.87,23.07 IC1.45
CTS  (1 unrouted)
  Top 0.152: IC5.38 79.12,44.7 79.06,44.77
DATA0  (via drill 0.3)
  Top 0.152: IC1.63 83.94,16.71 84.77,15.88 96.52,15.88 100.96,11.43 v103.82,11.43 103.68,11.29 44PINEDGE.2 | IC8.21 112.23,16.04 110.49,17.78 105.73,17.78 v105.41,17.46 | IC5.43 84.2,47.24 86.36,45.09 105.09,45.09 v105.41,44.77 105.73,45.09 106.04,45.09 107.63,46.67 IC2.13
  Bottom 0.152: v103.82,11.43 104.46,11.43 105.41,12.38 v105.41,17.46 v105.41,44.77
DATA1  (via drill 0.3)
  Top 0.152: IC1.62 83.14,16.55 84.45,15.24 95.88,15.24 v99.69,11.43 99.72,11.4 44PINEDGE.3 | IC8.22 112.73,16.49 110.49,18.73 103.82,18.73 v103.5,18.41 | IC2.14 111.44,46.67 110.81,47.31 107.31,47.31 106.04,46.04 103.82,46.04 v103.5,45.72 103.19,46.04 86.04,46.04 84.33,47.75 IC5.44
  Bottom 0.152: v99.69,11.43 101.28,13.02 102.87,13.02 103.5,13.65 v103.5,18.41 v103.5,45.72
DATA2  (via drill 0.3)
  Top 0.152: IC1.61 82.34,16.4 84.14,14.61 90.8,14.61 95.76,9.65 | 95.76,9.65 44PINEDGE.4 | 95.76,9.65 95.76,11.3 v95.88,11.43 | IC8.23 113.23,16.94 110.49,19.68 101.92,19.68 v101.6,19.37 | IC5.45 84.45,48.26 85.41,47.31 101.28,47.31 v101.6,46.99 101.92,47.31 104.46,47.31 105.73,48.58 111.12,48.58 112.71,46.99 IC2.15
  Bottom 0.152: v95.88,11.43 98.74,14.29 100.96,14.29 101.6,14.92 v101.6,19.37 v101.6,46.99
DATA3  (via drill 0.3)
  Top 0.152: IC1.60 81.54,16.25 83.82,13.97 89.53,13.97 v92.07,11.43 91.8,11.15 44PINEDGE.5 | IC8.25 114.23,16.89 110.49,20.64 100.01,20.64 v99.69,20.32 | IC5.46 84.65,48.77 84.77,48.58 99.38,48.58 v99.69,48.26 100.01,48.58 102.55,48.58 103.82,49.85 111.44,49.85 115.25,46.04 IC2.17
  Bottom 0.152: v92.07,11.43 96.2,15.56 99.06,15.56 99.69,16.19 v99.69,20.32 v99.69,48.26
DATA4  (via drill 0.3)
  Top 0.152: 44PINEDGE.6 87.83,11.32 v87.95,11.43 86.04,13.34 83.5,13.34 80.74,16.1 IC1.59 | IC8.26 114.73,17.35 110.49,21.59 98.11,21.59 v97.79,21.27 | IC5.47 84.84,49.28 85.41,49.85 97.47,49.85 v97.79,49.53 98.11,49.85 100.96,49.85 102.23,51.12 111.44,51.12 116.52,46.04 IC2.18
  Bottom 0.152: v87.95,11.43 93.34,16.83 97.16,16.83 97.79,17.46 v97.79,21.27 v97.79,49.53
DATA5  (via drill 0.3)
  Top 0.152: 44PINEDGE.7 83.87,11.16 v84.14,11.43 84.14,11.75 79.94,15.95 IC1.58 | IC8.27 115.23,17.8 110.49,22.54 96.2,22.54 v95.88,22.23 | IC5.2 81.66,51.82 81.91,52.07 95.57,52.07 v95.88,51.75 96.2,52.07 100.01,52.07 100.33,52.39 111.44,52.39 117.79,46.04 IC2.19
  Bottom 0.152: v84.14,11.43 90.8,18.1 95.25,18.1 95.88,18.73 v95.88,22.23 v95.88,51.75
DATA6  (via drill 0.3)
  Top 0.152: 44PINEDGE.8 79.91,11.33 v80.01,11.43 79.14,12.3 IC1.57 | IC8.28 115.73,18.25 110.49,23.5 94.3,23.5 v93.98,23.18 | IC5.3 81.15,51.94 82.55,53.34 93.66,53.34 v93.98,53.02 94.3,53.34 97.79,53.34 98.11,53.66 111.44,53.66 119.06,46.04 IC2.20
  Bottom 0.152: v80.01,11.43 87.95,19.37 93.34,19.37 93.98,20 v93.98,23.18 v93.98,53.02
DATA7  (via drill 0.3)
  Top 0.152: 44PINEDGE.9 75.95,11.18 v76.2,11.43 78.34,13.57 IC1.56 | IC8.29 116.23,18.7 110.49,24.45 93.66,24.45 v92.07,22.86 | IC5.4 80.64,52.07 82.87,54.29 91.76,54.29 v92.07,53.98 92.39,54.29 95.25,54.29 95.88,54.93 111.44,54.93 119.7,46.67 IC2.21
  Bottom 0.152: v76.2,11.43 85.41,20.64 91.44,20.64 92.07,21.27 v92.07,22.86 v92.07,53.98
DCD  (1 unrouted)
  Top 0.152: 78.1,45.72 IC5.40
DSR  (1 unrouted)
  Top 0.152: IC5.39 78.87,45.21 78.74,45.09
DTR  (via drill 0.3)  (1 unrouted)
  Top 0.152: IC5.33 80.64,42.23 v80.01,41.59
  Bottom 0.152: v80.01,41.59 79.69,41.27 74.61,41.27
EIA_CTS
  Top 0.152: X4.8 33.76,62.01 R10.1
  Bottom 0.152: X4.8 33.76,48.36 26.67,41.27 18.41,41.27 IC11.8
EIA_DSR  (1 unrouted)
  Top 0.152: X4.6 28.27,60.84 R14.1
EIA_DTR
  Bottom 0.152: X4.4 35.13,51.87 36.2,50.8 36.2,37.47 29.84,31.11 IC12.14
EIA_RTS
  Bottom 0.152: X4.7 31.01,48.79 26.03,43.81 18.41,43.81 IC11.7
EIA_RXD
  Bottom 0.152: X4.2 29.64,55.04 IC11.13
EIA_TXD
  Bottom 0.152: IC11.14 22.86,54.61 22.86,62.23 27.3,66.67 31.75,66.67 32.38,66.04 X4.3
GND  (via drill 0.3)  (4 unrouted)
  Top 1.778: 44PINEDGE.A 107.62,11.11 | 44PINEDGE.22 24.45,4.7 v24.45,12.06
  Bottom 1.778: 44PINEDGE.A 107.62,11.11 | 44PINEDGE.22 v24.46,12.06
  other vias: 107.63,11.43 113.98,46.35
  pour Top (isolate 0.178, no thermals): 20.95,75.56 20.95,70.48 0,70.48 0,11.11 132.08,11.11 132.08,70.48 111.12,70.48 111.12,75.56
  pour Bottom (isolate 0.178, no thermals): 0,11.11 132.08,11.11 132.08,70.48 111.12,70.48 111.12,75.56 20.95,75.56 20.95,70.48 0,70.48
MIDI_RXD  (1 unrouted)
  Top 0.152: IC7.13 41.27,58.42 40.01,57.15 38.31,57.15 R4.1 37.46,56.94 OK1.6 | IC4.13 55.25,48.26 52.07,45.09 50.8,45.09 47.62,41.91 IC4.2
MIDI_TXD  (via drill 0.3)  (1 unrouted)
  Top 0.152: v56.52,48.26 IC4.12 | IC4.7 53.98,41.27 53.98,41.91 v54.93,42.86
  Bottom 0.152: v56.52,48.26 56.52,44.45 v54.93,42.86
N$1
  Top 0.152: X3.5 103.19,58.1 R9.2
N$2
  Top 0.152: R9.1 87.31,58.1 85.72,56.52 48.26,56.52 46.36,54.61 IC7.6
N$3
  Top 0.152: R8.1 X3.4
N$4  (1 unrouted)
N$5
  Top 0.152: R15.2 LED1.A
N$6  (1 unrouted)
  Top 0.152: OK1.2 34.92,38.73 D1.C
N$7
  Top 0.152: R5.2 X1.4
N$8  (1 unrouted)
  Top 0.152: OK1.3 37.46,38.73 D1.A
N$9
  Top 0.152: OK1.7 34.92,46.99 29.21,41.27 R7.1
N$10
  Top 0.152: X2.5 84.77,57.89 R2.2
N$11
  Top 0.152: IC7.10 45.09,58.42 45.72,57.78 R2.1
N$12  (1 unrouted)
N$13
  Top 0.152: R1.1 X2.4
N$14  (2 unrouted)
  Top 0.152: IC1.2 85.21,21.47 79.38,27.3
N$15
  Top 0.152: R3.1 63.92,49.11 64.45,48.58 74.29,48.58 74.48,48.77 IC5.15
N$16
  Top 0.152: C1.1 Q1.1 69.6,49.53 R6.1 69.68,49.28 IC5.14
N$17
  Top 0.152: R3.2 R6.2 63.92,53.34 Q1.2 C2.1
N$18  (via drill 0.3)  (2 unrouted)
  Top 0.152: IC1.42 53.91,25.47 v52.7,26.67
  Bottom 0.152: S5.2 9.52,37.47 26.67,37.47 | v52.7,26.67 54.61,39.37 34.92,29.84
N$19  (1 unrouted)
N$20
  Top 0.152: R19.2 53.34,35.88 53.34,34.29 54.1,33.53 SJ4.2 57.87,30.27 IC1.36
N$21
  Top 0.152: R18.2 50.8,35.88 50.8,34.29 51.56,33.53 SJ5.2 56.93,28.67 IC1.38
N$23
  Top 0.152: R17.2 48.26,35.88 48.26,34.29 49.02,33.53 SJ6.2 55.19,27.87 IC1.39
N$24
  Top 0.152: R24.2 45.72,35.88 45.72,34.29 46.48,33.53 SJ7.2 53.45,27.07 IC1.40
N$25
  Top 0.152: R16.2 LED2.A
N$26
  Top 0.152: SJ2.2 59.81,33.41 | R21.2 58.42,35.88 58.42,34.29 59.18,33.53 SJ2.2 | IC1.34 61.35,31.87 SJ2.2
N$27  (via drill 0.3)  (1 unrouted)
  Top 0.152: IC1.1 85.06,20.67 v78.74,26.99 | v70.17,37.47 R12.1
  Bottom 0.152: v78.74,26.99 70.17,36.2 v70.17,37.47
N$28
  Top 0.152: R20.2 55.88,35.88 55.88,34.29 56.64,33.53 SJ3.2 59.61,31.07 IC1.35
N$29  (1 unrouted)
  Top 0.152: 61.02,35.94 R22.2 | IC1.33 63.09,32.67 SJ1.2
N$31  (via drill 0.3)  (1 unrouted)
  Top 0.152: IC5.30 79.12,42.29 v78.74,41.91 | R11.2 49.85,39.69 52.07,37.47
  Bottom 0.152: 75.56,41.91 v78.74,41.91
N$32
  Top 0.152: R11.1 T1.1
N$35  (1 unrouted)
  Top 0.152: IC4.19 47.62,48.9 46.99,48.26 46.99,41.91 46.36,41.27 IC4.1 | IC5.34 81.15,43.62 80.64,44.13
N$36
  Top 0.406: IC12.1 16.13,36.2 C3.+
N$37
  Top 0.406: IC12.3 13.59,31.11 C3.-
N$38
  Top 0.406: IC12.4 13.59,28.57 C4.+
N$39
  Top 0.406: IC12.5 13.59,26.04 C4.-
N$40
  Bottom 0.406: IC12.2 16.13,33.66 C5.+
N$41
  Top 0.406: IC12.6 13.59,23.5 C6.-
N$42
  Top 0.406: IC11.1 16.13,57.78 C7.+
N$43
  Top 0.406: IC11.3 13.59,52.7 C7.-
N$44
  Top 0.406: IC11.4 13.66,50.16 C8.+
N$45
  Top 0.406: IC11.5 13.66,47.62 C8.-
N$46
  Bottom 0.406: IC11.2 16.13,55.24 C9.+
N$47
  Top 0.406: IC11.6 13.59,45.09 C10.-
N$56  (1 unrouted)
  Top 0.152: X4.1 26.9,59.99 R13.1
PE  (3 unrouted)
PHI2  (via drill 0.3)
  Top 0.152: IC1.15 85.21,31.87 v84.93,31.59 | IC5.10 77.6,50.35 v77.79,50.16
  Bottom 0.152: 44PINEDGE.V 40.28,9.49 55.56,24.77 80.96,24.77 84.93,28.73 v84.93,31.59 84.93,32.86 87.63,35.56 87.63,40.32 87.63,41.91 79.38,50.16 v77.79,50.16
RS232_RXD  (1 unrouted)
  Top 0.152: IC4.4 50.16,41.91 53.34,45.09 55.88,45.09 57.79,46.99 IC4.11
RS232_TXD  (via drill 0.3)  (1 unrouted)
  Top 0.152: IC4.3 v48.9,41.91 | v51.44,48.26 IC4.16
  Bottom 0.152: v48.9,41.91 48.9,45.72 v51.44,48.26
RTS  (1 unrouted)
  Top 0.152: IC5.32 80.14,43.37 79.69,43.81
RXD  (via drill 0.3)  (1 unrouted)
  Top 0.152: v48.9,52.07 IC4.18 48.9,47.62 v50.16,46.35 | v55.25,44.45 56.52,43.18 IC4.9
  Bottom 0.152: LED2.K 45.72,67.31 48.9,64.14 v48.9,52.07 | v50.16,46.35 53.34,46.35 v55.25,44.45
TXD  (via drill 0.3)  (1 unrouted)
  Top 0.152: v50.16,52.07 IC4.17 50.16,48.26 51.44,46.99 v51.44,45.72 | v55.25,41.91 IC4.8
  Bottom 0.152: LED1.K 5.71,68.58 45.72,68.58 50.16,64.14 v50.16,52.07 | v51.44,45.72 v55.25,41.91
UART_CE  (1 unrouted)
VCC  (via drill 0.3)  (17 unrouted)
  Top 0.152: R1.2 69.85,60.33 69.85,62.87 71.44,64.45 72.71,64.45 79.38,71.12 | R8.2 90.59,62.97 92.07,64.45 93.34,64.45 100.01,71.12 | IC7.14 39.05,59.59 R4.2 | 24.77,60.07 24.19,60.01 | 29.53,57.78 R14.2 | C9.- 11.39,62.02 R16.1 R15.1
  Top 0.305: IC8.8 114.23,29.91 v114.3,29.84 | IC5.19 IC5.42
  Top 0.406: 20.95,60.07 C9.- | C5.- 20.95,38.48 22.48,38.48 IC12.16
  Top 0.61: 40.01,71.12 IC7.14
  Top 0.813: 44PINEDGE.21 28.4,10.97 | 28.4,10.97 23.49,15.88 | 23.49,15.88 20.95,18.41 20.95,38.48 20.95,60.07 24.77,60.07 | 24.77,60.07 24.77,71.12 40.01,71.12 79.38,71.12 100.01,71.12 104.77,71.12 104.77,64.77 v116.52,64.77 | 24.77,60.07 IC11.16 29.53,57.78 | R13.2 R14.2 32.38,57.89 OK1.8 | C17.1 23.49,15.88 | 28.4,10.97 28.44,10.97 31.12,13.65 31.12,15.24 | 31.12,15.24 VR1.2 | 31.12,15.24 C11.1
  Bottom 0.61: v116.52,57.15 116.52,32.07 v114.3,29.84
  Bottom 0.813: v116.52,64.77 v116.52,57.15
VDD  (via drill 0.3)  (1 unrouted)
  Top 0.305: IC1.37 72.39,29.47 72.46,29.4 v72.46,26.67 72.71,26.35 76.2,22.86 v77.47,21.59 77.54,21.52 IC1.55 | v85.04,22.27 IC1.3
  Top 0.813: VR1.3 29.21,17.78 29.21,17.46 C12.1
  Bottom 0.305: v85.04,22.27 77.47,22.27 v77.47,21.59
  Bottom 0.61: VR1.3 41.91,26.67 v72.46,26.67

### Text on the board
tPlace: VIC-20 Cartridge Template | (c) 2005-09 Brain Innovations